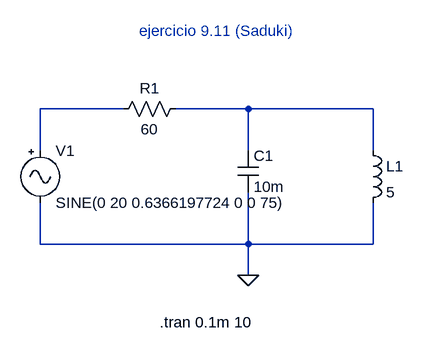
[diagram p0: schematic RSPbasico.asc]
RSPbasico.asc, the LTspice schematic file:
Version 4
SHEET 1 880 680
WIRE 304 240 176 240
WIRE 496 240 384 240
WIRE 688 240 496 240
WIRE 176 304 176 240
WIRE 496 304 496 240
WIRE 688 304 688 240
WIRE 176 448 176 384
WIRE 496 448 496 368
WIRE 496 448 176 448
WIRE 688 448 688 384
WIRE 688 448 496 448
WIRE 496 496 496 448
FLAG 496 496 0
SYMBOL Res 288 256 R270
WINDOW 0 32 56 VTop 2
WINDOW 3 0 56 VBottom 2
SYMATTR InstName R1
SYMATTR Value 60
SYMBOL Misc/signal 176 288 R0
SYMATTR InstName V1
SYMATTR Value SINE(0 20 0.6366197724 0 0 75)
SYMBOL Cap 480 304 R0
SYMATTR InstName C1
SYMATTR Value 10m
SYMBOL Ind 672 288 R0
SYMATTR InstName L1
SYMATTR Value 5
TEXT 360 568 Left 2 !.tran 0.1m 10
TEXT 328 120 Left 2 ;ejercicio 9.11 (Saduki)

The netlist it stands for:
* RSPbasico.asc
R1 N001 N002 60
V1 N001 0 SINE(0 20 0.6366197724 0 0 75)
C1 N002 0 10m
L1 N002 0 5
.tran 0.1m 10
* ejercicio 9.11 (Saduki)
.backanno
.end